# EasyEDA Pro project ProPrj_PCB_2025-05-19.epro, board 手指0.1
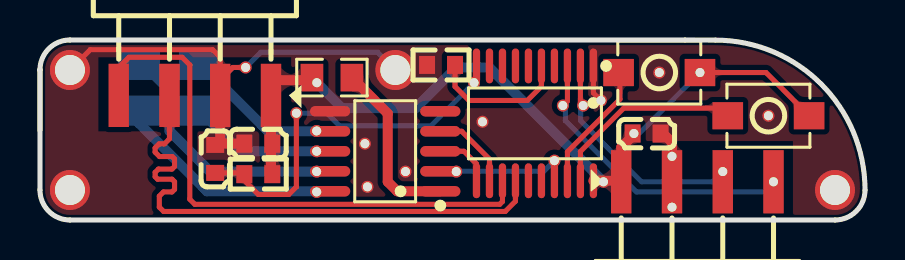
[diagram p2: board, top side]
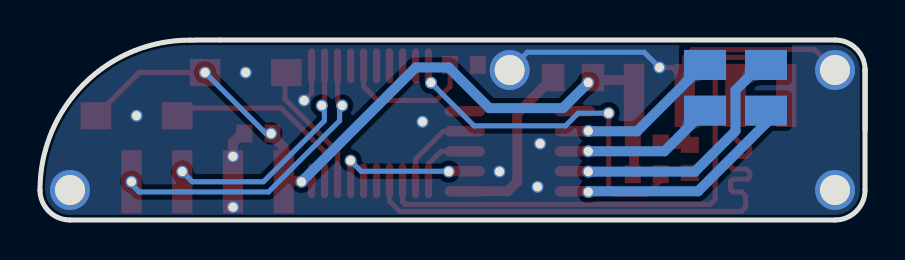
[diagram p3: board, bottom side, seen from below]

Outline 41.29 x 9 mm; copper layers: Top Layer, Bottom Layer. Coordinates in mm from the lower left corner of the outline.
Outline path: 0,7.53 arc(0.45,8.57) 1.5,9 32.28,9 33.78,8.99 arc(39.09,6.8) 41.29,1.49 arc(40.84,0.44) 39.78,0 1.5,0 arc(0.44,0.44) 0,1.5 0,7.47 arc(0,7.5) 0,7.53 ; 0,7.53 0,4.49
Stack: Top Layer 0.035mm / Dielectric1 1.51mm FR4 er 4.5 / Bottom Layer 0.035mm

## Design rules (mm)
template: 自定义配置
spacing copperThickness1oz (default): track to track 0.102, other pairs 0.152 to 0.3
spacing copperThickness2oz: track to track 0.203, other pairs 0.152 to 0.3
track width copperThickness1oz (default): min 0.127, default 0.254, max 2.54
track width copperThickness2oz: min 0.203, default 0.254, max 2.54
differential pair differentialPair (default): width min 0.127, default 0.254, max 2.54; gap min 0.152, default 0.152
via viaSize (default): diameter min 0.5, default 0.61, max 10; hole min 0.3, default 0.305, max 6.3

## Placement (name value [footprint] x y rotation side)
C28  10uF  [C0603]  8.77 3.06 270 top
C32  10uF  [C0603]  10.93 3.82 0 top
C33  10uF  [C0603]  30.36 4.33 180 top
H1  KH-2.54PH-1X4P-L13.5-WT  [HDR-SMD_4P-P2.54-H-M-W13.3-N]  32.9 1.91 0 top
H2  KH-2.54PH-1X4P-L13.5-WT  [HDR-SMD_4P-P2.54-H-M-W13.3-N]  7.75 6.23 180 top
k1  k1  [SW-SMD_L4.0-W2.9-LS5.0]  30.99 7.37 0 top
k2  k2  [SW-SMD_L4.0-W2.9-LS5.0]  36.45 5.21 0 top
NOREF  -  [Pad_e901]  28.2 1.91 0 top
NOREF#2  -  [Pad_e997]  28.07 5.98 0 top
NOREF#3  -  [Pad_e948]  36.71 1.91 0 top
NOREF#4  -  [Pad_e909]  25.74 2.97 0 top
NOREF#5  -  [Pad_e7]  39.78 1.5 0 top
NOREF#6  -  [Pad_e470]  22.14 4.91 0 top
NOREF#7  -  [Pad_e951]  26.17 5.72 0 top
NOREF#8  -  [Pad_e20]  12.83 5.34 0 top
NOREF#9  -  [Pad_e97]  13.86 6.86 0 top
NOREF#10  -  [Pad_e267]  30.99 7.37 0 top
NOREF#11  -  [Pad_e981]  33.03 7.37 0 top
NOREF#12  -  [Pad_e334]  13.85 4.45 0 top
NOREF#13  -  [Pad_e73]  8.01 7.75 0 top
NOREF#14  -  [Pad_e478]  16.26 3.82 0 top
NOREF#15  -  [Pad_e114]  16.39 1.66 0 top
NOREF#16  -  [Pad_e331]  13.85 1.4 0 top
NOREF#17  -  [Pad_e985]  31.63 3.18 0 top
NOREF#18  -  [Pad_e920]  21.72 6.86 0 top
NOREF#19  -  [Pad_e968]  29.72 4.33 0 top
NOREF#20  -  [Pad_e477]  18.29 2.42 0 top
NOREF#21  -  [Pad_e0]  17.78 7.5 0 top
NOREF#22  -  [Pad_e71]  4.96 7.75 0 top
NOREF#23  -  [Pad_e74]  4.96 5.47 0 top
NOREF#24  -  [Pad_e21]  1.5 1.5 0 top
NOREF#25  -  [Pad_e332]  13.85 2.42 0 top
NOREF#26  -  [Pad_e947]  34.17 2.42 0 top
NOREF#27  -  [Pad_e268]  36.45 5.21 0 top
NOREF#28  -  [Pad_e322]  20.83 2.42 0 top
NOREF#29  -  [Pad_e333]  13.85 3.44 0 top
NOREF#30  -  [Pad_e370]  10.29 7.63 0 top
NOREF#31  -  [Pad_e22]  1.5 7.5 0 top
NOREF#32  -  [Pad_e952]  27.18 5.72 0 top
NOREF#33  -  [Pad_e1289]  31.63 0.64 0 top
NOREF#34  -  [Pad_e75]  8.01 5.47 0 top
R14  10K  [R0603]  20.07 7.75 180 top
R57  10K  [R0603]  10.93 2.29 0 top
R58  10  [R0805]  14.61 7.12 180 top
U2  AT8549  [SSOP-10_L4.9-W3.9-P1.00-LS6.0-BL]  17.28 3.44 90 top
U6  PY32F002A  [TSSOP-20_L6.5-W4.4-P0.65-LS6.4-BL]  24.77 4.83 180 top

## Footprints (pads in the part's own frame, mm; a bottom-side part is the same pattern mirrored in y, then rotated)
C0603
  rect 0.8x0.9 smd: 1(-0.7,0) 2(0.7,0)
HDR-SMD_4P-P2.54-H-M-W13.3-N
  rect 1.02x3.16 smd: 1(-3.81,0) 2(-1.27,0) 3(1.27,0) 4(3.81,0)
Pad_e0
  round 2 hole 1.5: 1(0,0)
Pad_e7
  round 2 hole 1.5: 1(0,0)
Pad_e20
  round 0.6 hole 0.45: 1(0,0)
Pad_e21
  round 2 hole 1.5: 1(0,0)
Pad_e22
  round 2 hole 1.5: 1(0,0)
Pad_e71
  rect 2.1x1.5 smd far side: 1(0,0)
Pad_e73
  rect 2.1x1.5 smd far side: 1(0,0)
Pad_e74
  rect 2.1x1.5 smd far side: 1(0,0)
Pad_e75
  rect 2.1x1.5 smd far side: 1(0,0)
Pad_e97
  round 0.6 hole 0.45: 1(0,0)
Pad_e114
  round 0.6 hole 0.45: 1(0,0)
Pad_e267
  round 0.6 hole 0.45: 1(0,0)
Pad_e268
  round 0.6 hole 0.45: 1(0,0)
Pad_e322
  round 0.6 hole 0.45: 1(0,0)
Pad_e331
  round 0.6 hole 0.45: 1(0,0)
Pad_e332
  round 0.6 hole 0.45: 1(0,0)
Pad_e333
  round 0.6 hole 0.45: 1(0,0)
Pad_e334
  round 0.6 hole 0.45: 1(0,0)
Pad_e370
  round 0.6 hole 0.45: 1(0,0)
Pad_e470
  round 0.6 hole 0.45: 1(0,0)
Pad_e477
  round 0.6 hole 0.45: 1(0,0)
Pad_e478
  round 0.6 hole 0.45: 1(0,0)
Pad_e901
  round 0.6 hole 0.45: 1(0,0)
Pad_e909
  round 0.6 hole 0.45: 1(0,0)
Pad_e920
  round 0.6 hole 0.45: 1(0,0)
Pad_e947
  round 0.6 hole 0.45: 1(0,0)
Pad_e948
  round 0.6 hole 0.45: 1(0,0)
Pad_e951
  round 0.6 hole 0.45: 1(0,0)
Pad_e952
  round 0.6 hole 0.45: 1(0,0)
Pad_e968
  round 0.6 hole 0.45: 1(0,0)
Pad_e981
  round 0.6 hole 0.45: 1(0,0)
Pad_e985
  round 0.6 hole 0.45: 1(0,0)
Pad_e997
  round 0.6 hole 0.45: 1(0,0)
Pad_e1289
  round 0.6 hole 0.45: 1(0,0)
R0603
  rect 0.8x0.9 smd: 1(-0.7,0) 2(0.7,0)
R0805
  rect 1.133x1.377 smd: 1(-1,0) 2(1,0)
SSOP-10_L4.9-W3.9-P1.00-LS6.0-BL
  oval 0.525x2.014 smd: 1(-2,-2.756) 2(-1,-2.756) 3(0,-2.756) 4(1,-2.756) 5(2,-2.756) 6(2,2.756) 7(1,2.756) 8(0,2.756) 9(-1,2.756) 10(-2,2.756)
SW-SMD_L4.0-W2.9-LS5.0
  rect 1.53x1.36 smd: 1(-2.035,0) 2(2.035,0)
TSSOP-20_L6.5-W4.4-P0.65-LS6.4-BL
  oval 0.364x1.742 smd: 1(-2.925,-2.871) 2(-2.275,-2.871) 3(-1.625,-2.871) 4(-0.975,-2.871) 5(-0.325,-2.871) 6(0.325,-2.871) 7(0.975,-2.871) 8(1.625,-2.871) 9(2.275,-2.871) 10(2.925,-2.871) 11(2.925,2.871) 12(2.275,2.871) 13(1.625,2.871) 14(0.975,2.871) 15(0.325,2.871) 16(-0.325,2.871) 17(-0.975,2.871) 18(-1.625,2.871) 19(-2.275,2.871) 20(-2.925,2.871)

## Nets
GND: C28.1 C32.1 C33.1 H1.2 H2.2 NOREF#2.1 NOREF#5.1 NOREF#6.1 NOREF#10.1 NOREF#14.1 NOREF#15.1 NOREF#17.1 NOREF#20.1 NOREF#21.1 NOREF#24.1 NOREF#27.1 NOREF#30.1 NOREF#31.1 NOREF#33.1 R14.2 U2.6 U6.1
A+: NOREF#16.1 NOREF#23.1 U2.10
A-: NOREF#22.1 NOREF#25.1 U2.9
B+: NOREF#29.1 NOREF#34.1 U2.8
B-: NOREF#12.1 NOREF#13.1 U2.7
PY32F002A_VCC: C32.2 C33.2 H1.1 H2.1 k1.2 k2.2 NOREF.1 NOREF#9.1 NOREF#11.1 NOREF#19.1 R57.2 R58.2 U6.20
PY_NRST: C28.2 NOREF#8.1 NOREF#18.1 R57.1 U6.10
PY_PA0: U2.3 U6.11
PY_PA1: U2.4 U6.12
PY_PA2: H2.4 U6.13
PY_PA3: H2.3 U6.14
PY_PA4: U6.15
PY_PA5: U6.7
PY_PA6: U6.6
PY_PA7: U6.16
PY_PA13: H1.3 NOREF#26.1 NOREF#32.1 U6.2
PY_PA14: H1.4 NOREF#3.1 NOREF#7.1 U6.3
PY_PB0: NOREF#4.1 NOREF#28.1 U2.2 U6.17
PY_PB1: k2.1 U6.19
PY_PB2: k1.1 U6.18
PY_PB3: U6.4
PY_PB6: R14.1 U6.5
PY_PF0: U6.8
PY_PF1: U6.9
$1N1947: R58.1 U2.1

Pads without a net: U2 5

## Routing (per net, layer and track width the routed paths; a pad name or vN(x,y) marks a point on that pad's centre or on a via; arc(x,y) is an arc through that point)
GND: length 26.4
  Top Layer w0.254: 9.02,6.99 9.02,6.61 ; 9.02,6.99 9.66,7.63 NOREF#30.1 ; 9.02,6.99 9.02,8.14 8.64,8.52 2.52,8.52 NOREF#31.1 ; U6.1 27.69,6.35 NOREF#2.1
  Top Layer w0.5: H2.2 9.02,4.01 8.83,3.82 C32.1 ; NOREF#17.1 31.63,3.88 31.18,4.33
  Bottom Layer w0.254: NOREF#21.1 16.9,8.39 11.05,8.39 NOREF#30.1
A+: length 10.9
  Bottom Layer w0.5: NOREF#23.1 4.96,4.83 8.35,1.44 13.82,1.44 NOREF#16.1
A-: length 12.3
  Bottom Layer w0.5: NOREF#25.1 8.51,2.42 6.48,4.45 6.48,6.48 5.21,7.75 NOREF#22.1
B+: length 6.7
  Bottom Layer w0.5: NOREF#29.1 10.04,3.44 NOREF#34.1
B-: length 7.2
  Bottom Layer w0.5: NOREF#13.1 8.09,7.75 11.41,4.44 13.83,4.44 NOREF#12.1
PY32F002A_VCC: length 40.1
  Top Layer w0.254: NOREF#11.1 36.33,7.37 k2.2
  Top Layer w0.5: 29.78,4.33 29.09,3.63 H1.1 29.04,1.96 U6.20 ; NOREF#9.1 13.73,6.99 11.69,6.99 11.56,6.86 H2.1 11.56,2.36 R57.2
  Bottom Layer w0.254: NOREF#11.1 29.98,4.33 NOREF#19.1
  Bottom Layer w0.5: NOREF.1 22.48,7.63 20.83,7.63 18.8,5.59 15.12,5.59 13.85,6.86
PY_NRST: length 18.7
  Top Layer w0.254: NOREF#8.1 12.83,1.66 12.45,1.28 10.93,1.28 10.23,1.98 R57.1 10.16,2.36 C28.2
  Bottom Layer w0.254: 21.85,6.74 21.59,6.74 19.56,4.71 14.99,4.71 14.36,5.34 NOREF#8.1
PY_PA0: length 3.2
  Top Layer w0.254: U2.3 21.21,3.44 21.84,2.81 21.84,1.71
PY_PA1: length 4.6
  Top Layer w0.254: 22.49,1.45 22.49,3.04 21.1,4.44 U2.4
PY_PA2: length 28.5
  Top Layer w0.254: U6.13 23.14,0.92 23.01,0.78 7.75,0.78 7.5,1.04 7.5,7.75 7.12,8.14 4.45,8.14 3.94,7.63 3.94,6.61
PY_PA3: length 28.5
  Top Layer w0.254: U6.14 23.79,0.94 23.28,0.43 6.19,0.43 5.97,0.64 5.97,1.19 6.18,1.4 6.61,1.4 6.74,1.53 6.74,1.91 6.61,2.04 5.89,2.04 5.76,2.17 5.76,2.38 5.93,2.55 6.61,2.55 6.74,2.67 6.74,3.06 6.62,3.17 5.98,3.17 5.76,3.39 5.76,3.61 5.97,3.81 6.23,3.81 6.48,4.06 6.48,6.61
PY_PA13: length 11.4
  Top Layer w0.254: U6.2 27.04,5.86 NOREF#32.1
  Bottom Layer w0.254: NOREF#32.1 27.06,5.59 27.06,4.96 30.1,1.91 33.66,1.91 NOREF#26.1
PY_PA14: length 15.1
  Top Layer w0.254: NOREF#7.1 26.39,5.95 U6.3
  Bottom Layer w0.254: NOREF#3.1 36.71,1.78 36.33,1.4 29.85,1.4 26.29,4.96 26.29,5.47 26.17,5.59 NOREF#7.1
PY_PB0: length 6.7
  Top Layer w0.254: 25.74,1.45 NOREF#4.1
  Bottom Layer w0.254: NOREF#28.1 20.85,2.44 25.21,2.44 NOREF#4.1
PY_PB1: length 10.4
  Top Layer w0.254: k2.1 34.04,5.59 29.21,5.59 27.04,3.42 27.04,1.45
PY_PB2: length 7
  Top Layer w0.254: 26.39,1.45 26.39,2.48 26.39,3.41 29.02,6.04 29.02,7.31 k1.1
PY_PB6: length 6.5
  Top Layer w0.254: 25.09,7.2 25.09,6.68 24.39,5.98 21.47,5.98 20.77,6.67 R14.1
$1N1947: length 8.8
  Top Layer w0.5: R58.1 17.4,5.33 17.4,1.91 17.88,1.44 U2.1

## Copper pours and planes (outline as drawn; the poured copper is in the pictures)
GND on Top Layer: -1.52,10.67 42.04,10.67 42.04,-1.14 -1.52,-1.14
GND on Bottom Layer: -2.41,12.58 44.33,12.58 44.33,-4.31 -2.41,-4.31

Small or netless copper shapes (teardrops, artwork), in the pictures only: 53 on Top Layer, 21 on Bottom Layer
